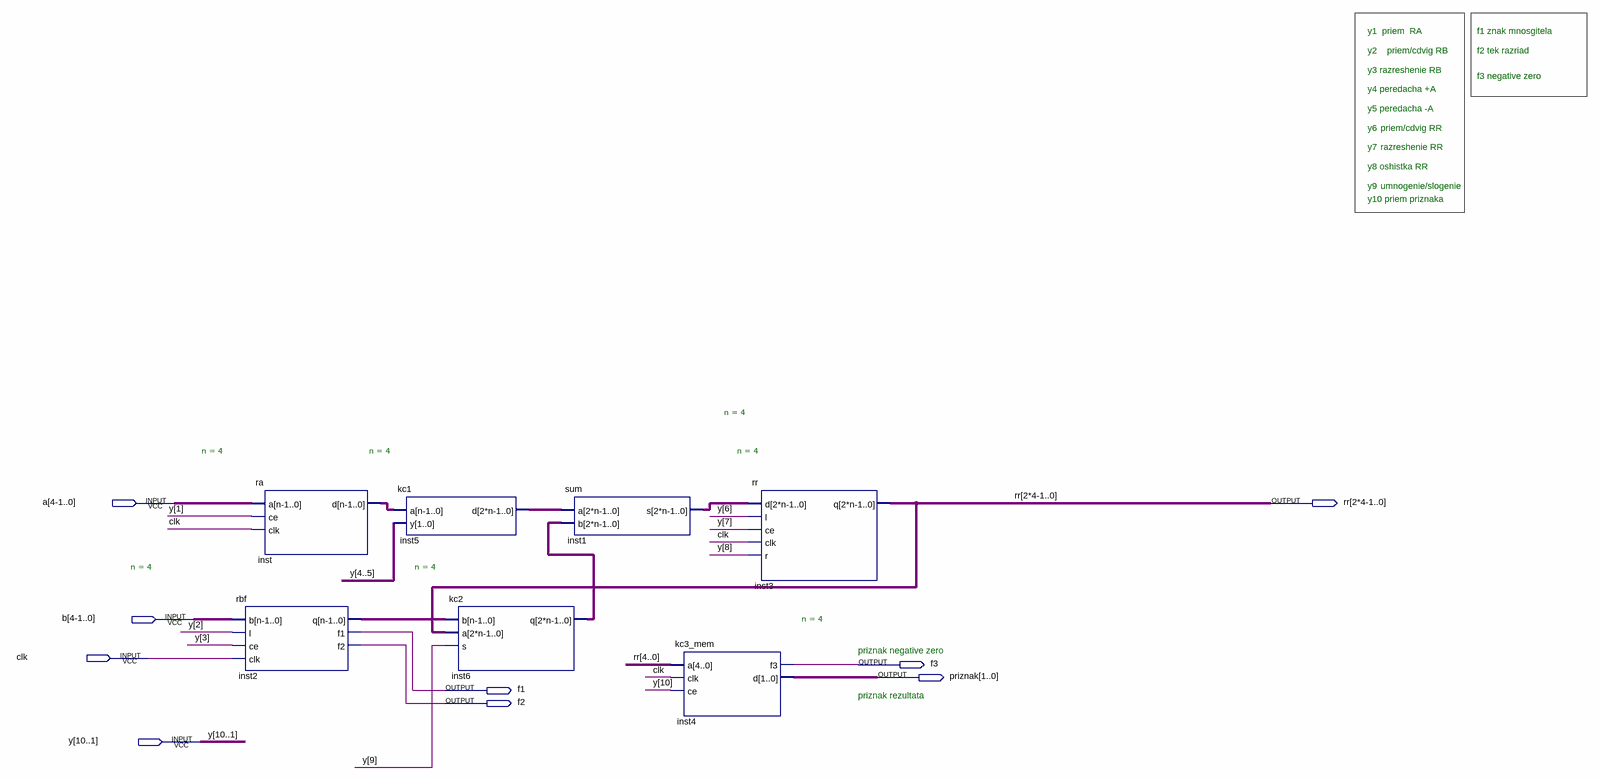
[diagram p0: schematic sheet]
// Quartus schematic blok_oper.bdf as structural Verilog: 7 symbols, 9 pins
module blok_oper (
  input  \a[4-1..0] ,
  input  \b[4-1..0] ,
  input  clk,
  input  [10:1] y,
  output \rr[2*4-1..0] ,
  output f3,
  output [1:0] priznak,
  output f1,
  output f2
);

  wire [3:0] inst2_q, inst_d, undriven, undriven_2;
  wire [4:0] rr;
  wire [7:0] inst1_s, inst5_d, inst6_q;

  ra #(.n(4)) inst (.a(undriven), .ce(y[1]), .clk(clk), .d(inst_d));
  rbf #(.n(4)) inst2 (.b(undriven_2), .l(y[2]), .ce(y[3]), .clk(clk), .q(inst2_q), .f1(f1), .f2(f2));
  kc1 #(.n(4)) inst5 (.a(inst_d), .y({y[4], y[5]}), .d(inst5_d));
  kc2 #(.n(4)) inst6 (.b(inst2_q), .a({8{\rr[2*4-1..0] }}), .s(y[9]), .q(inst6_q));
  sum #(.n(4)) inst1 (.a(inst5_d), .b(inst6_q), .s(inst1_s));
  kc3_mem #(.n(4)) inst4 (.a(rr), .clk(clk), .ce(y[10]), .f3(f3), .d(priznak));
  rr #(.n(4)) inst3 (.d(inst1_s), .l(y[6]), .ce(y[7]), .clk(clk), .r(y[8]), .q(\rr[2*4-1..0] ));

  // Notes on the sheet:
  //   y1  priem  RA
  //   f1 znak mnosgitela
  //   y2 
  //   priem/cdvig RB
  //   f2 tek razriad
  //   y3 razreshenie RB
  //   f3 negative zero
  //   y4 peredacha +A
  //   y5 peredacha -A
  //   y6 
  //   priem/cdvig RR
  //   y7 
  //   razreshenie RR
  //   y8 oshistka RR
  //   y9 
  //   umnogenie/slogenie
  //   y10 priem priznaka
  //   priznak negative zero
  //   priznak rezultata
endmodule
